# EAGLE schematic circuit (EAGLE 7.0.0)
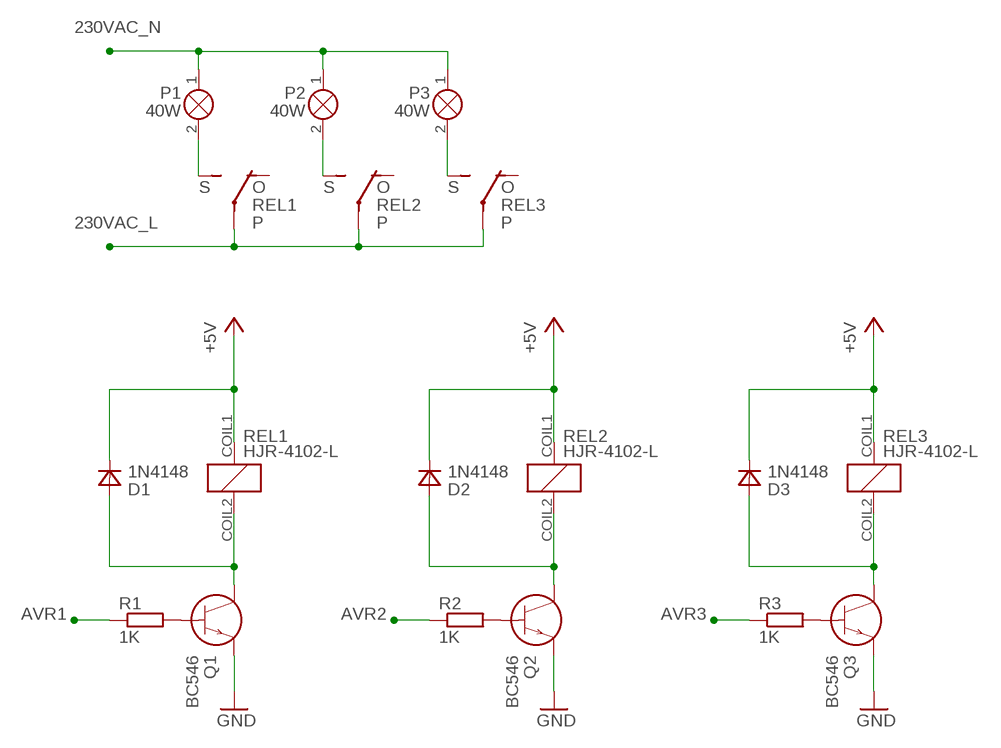
[diagram p0: schematic, sheet 1]

## Parts
D1  1N4148  DIODE  [DIODE]
D2  1N4148  DIODE  [DIODE]
D3  1N4148  DIODE  [DIODE]
P1  40W  SIGNALLAMPE  [LAMPE]
P2  40W  SIGNALLAMPE  [LAMPE]
P3  40W  SIGNALLAMPE  [LAMPE]
Q1  BC546  NPN-TRANSISTOR  [NPN-TRANSISTOR]
Q2  BC546  NPN-TRANSISTOR  [NPN-TRANSISTOR]
Q3  BC546  NPN-TRANSISTOR  [NPN-TRANSISTOR]
R1  1K  R-EU_0207/15  [0207/15]
R2  1K  R-EU_0207/15  [0207/15]
R3  1K  R-EU_0207/15  [0207/15]
REL1  HJR-4102-L  [HJR4102]
REL2  HJR-4102-L  [HJR4102]
REL3  HJR-4102-L  [HJR4102]

## Nets
230VAC_L: REL1.CENTER1(P) REL1.CENTER2(P2) REL2.CENTER1(P) REL2.CENTER2(P2) REL3.CENTER1(P) REL3.CENTER2(P2)
230VAC_N: P1.1(X1) P2.1(X1) P3.1(X1)
+5V: D1.A D2.A D3.A REL1.COIL1 REL2.COIL1 REL3.COIL1
AVR1: R1.1
AVR2: R2.1
AVR3: R3.1
GND: Q1.E Q2.E Q3.E
N$1: P1.2(X2) REL1.CON1DEFAULT(S)
N$2: P2.2(X2) REL2.CON1DEFAULT(S)
N$3: P3.2(X2) REL3.CON1DEFAULT(S)
N$4: D1.C Q1.C REL1.COIL2
N$5: D2.C Q2.C REL2.COIL2
N$6: D3.C Q3.C REL3.COIL2
N$8: Q1.B R1.2
N$9: Q2.B R2.2
N$10: Q3.B R3.2
Unconnected: REL1.CON2OPTION(O) REL2.CON2OPTION(O) REL3.CON2OPTION(O)

## Library data of the parts
D1-D3 = e-halbleiter:DIODE: Diode
P1-P3 = e-lampen-signalisation:SIGNALLAMPE: Lampe
Q1-Q3 = e-halbleiter:NPN-TRANSISTOR: NPN-Transistor
R1-R3 = rcl:R-EU_: RESISTOR, European symbol
REL1-REL3 = relay:HJR-4102-L